# EAGLE design wifiToNmea2000 (EAGLE 7.7.0)
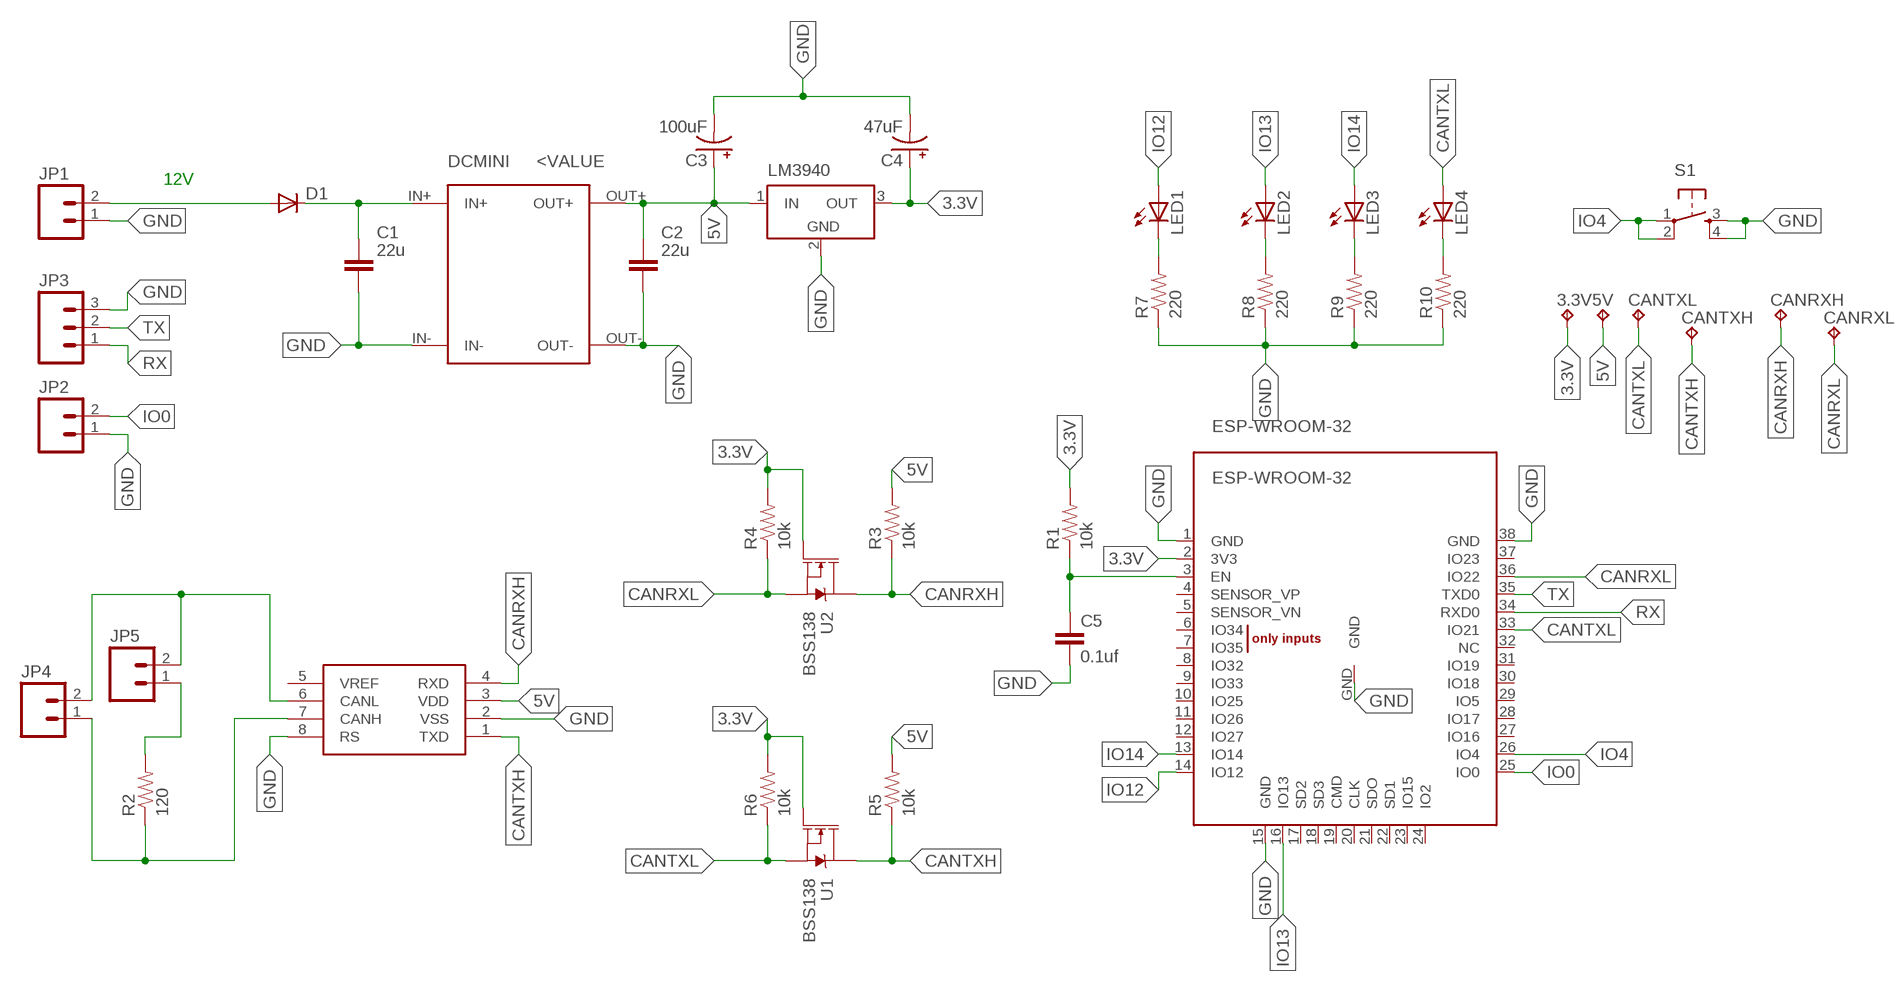
[diagram p0: schematic, sheet 1]

## Parts
3.3V  TPTP20R  [TP20R]
5V  TPTP20R  [TP20R]
C1  22u  CAPACITOR_NPOL-1206  [C1206]
C2  22u  CAPACITOR_NPOL-1206  [C1206]
C3  100uF  CAP_POLD  [PANASONIC_D]
C4  47uF  CAP_POLD  [PANASONIC_D]
C5  0.1uf  CAP0805  [0805]
CANRXH  TPTP20R  [TP20R]
CANRXL  TPTP20R  [TP20R]
CANTXH  TPTP20R  [TP20R]
CANTXL  TPTP20R  [TP20R]
D1  DIODE-DO214AC  [DO214AC]
DCMINI  DCDCMINI  [DCDCMINI]
ESP-WROOM-32  ESP-WROOM-32  [ESP-WROOM-32]
JP1  M02  [1X02_LONGPADS]
JP2  M02LOCK  [1X02_LOCK]
JP3  M03LOCK  [1X03_LOCK]
JP4  M02  [1X02_LONGPADS]
JP5  M02LOCK  [1X02_LOCK]
LED1  LED3MM  [LED3MM]
LED2  LED3MM  [LED3MM]
LED3  LED3MM  [LED3MM]
LED4  LED3MM  [LED3MM]
LM3940  LT1129CST5  [SOT223]
MCP2551  MCP2551  [SO08]
R1  10k  RESISTOR  [0805]
R2  120  RESISTOR  [0805]
R3  10k  RESISTOR  [0805]
R4  10k  RESISTOR  [0805]
R5  10k  RESISTOR  [0805]
R6  10k  RESISTOR  [0805]
R7  220  RESISTOR  [0805]
R8  220  RESISTOR  [0805]
R9  220  RESISTOR  [0805]
R10  220  RESISTOR  [0805]
S1  TAC_SWITCHPTH  [TACTILE-PTH]
U1  BSS138  BSS138BKW  [SOT65P210X110-3N]
U2  BSS138  BSS138BKW  [SOT65P210X110-3N]

## Nets
3.3V [Supply]: 3.3V.TP C4.+ ESP-WROOM-32.2(3V3) LM3940.3(OUT) R1.2 R4.2 R6.2 U1.1(G) U2.1(G)
5V [Supply]: 5V.TP C2.1 C3.+ DCMINI.OUT+ LM3940.1(IN) MCP2551.3(VDD) R3.2 R5.2
CANRXH: CANRXH.TP MCP2551.4(RXD) R3.1 U2.3(D)
CANRXL: CANRXL.TP ESP-WROOM-32.36(IO22) R4.1 U2.2(S)
CANTXH: CANTXH.TP MCP2551.1(TXD) R5.1 U1.3(D)
CANTXL: CANTXL.TP ESP-WROOM-32.33(IO21) LED4.A R6.1 U1.2(S)
GND: C1.2 C2.2 C3.- C4.- C5.2 DCMINI.IN- DCMINI.OUT- ESP-WROOM-32.1(GND) ESP-WROOM-32.15(GND) ESP-WROOM-32.38(GND) ESP-WROOM-32.GND JP1.1 JP2.1 JP3.3 LM3940.2(GND) MCP2551.2(VSS) MCP2551.8(RS) R7.1 R8.1 R9.1 R10.1 S1.3 S1.4
IO0: ESP-WROOM-32.25(IO0) JP2.2
IO4: ESP-WROOM-32.26(IO4) S1.1 S1.2
IO12: ESP-WROOM-32.14(IO12) LED1.A
IO13: ESP-WROOM-32.16(IO13) LED2.A
IO14: ESP-WROOM-32.13(IO14) LED3.A
N$1 [Supply]: D1.A JP1.2
N$2 [Supply]: C1.1 D1.C DCMINI.IN+
N$3 [Supply]: JP4.1 MCP2551.7(CANH) R2.1
N$4: JP4.2 JP5.2 MCP2551.6(CANL)
N$5: C5.1 ESP-WROOM-32.3(EN) R1.1
N$6: JP5.1 R2.2
N$7: LED1.K(C) R7.2
N$8: LED2.K(C) R8.2
N$9: LED3.K(C) R9.2
N$10: LED4.K(C) R10.2
RX: ESP-WROOM-32.34(RXD0) JP3.1
TX: ESP-WROOM-32.35(TXD0) JP3.2
Unconnected: ESP-WROOM-32.4(SENSOR_VP) ESP-WROOM-32.5(SENSOR_VN) ESP-WROOM-32.6(IO34) ESP-WROOM-32.7(IO35) ESP-WROOM-32.8(IO32) ESP-WROOM-32.9(IO33) ESP-WROOM-32.10(IO25) ESP-WROOM-32.11(IO26) ESP-WROOM-32.12(IO27) ESP-WROOM-32.17(SD2) ESP-WROOM-32.18(SD3) ESP-WROOM-32.19(CMD) ESP-WROOM-32.20(CLK) ESP-WROOM-32.21(SDO) ESP-WROOM-32.22(SD1) ESP-WROOM-32.23(IO15) ESP-WROOM-32.24(IO2) ESP-WROOM-32.27(IO16) ESP-WROOM-32.28(IO17) ESP-WROOM-32.29(IO5) ESP-WROOM-32.30(IO18) ESP-WROOM-32.31(IO19) ESP-WROOM-32.32(NC) ESP-WROOM-32.37(IO23) MCP2551.5(VREF)

## Notes on the sheet
- 12V

## Power pins joined to a net without a drawn wire
GND: LM3940.4(GND)

## Library data of the parts
3.3V 5V CANRXH CANRXL CANTXH CANTXL = testpad:TP: Test pad
C1 C2 = dp_devices.v6:CAPACITOR_NPOL: Non-Polarized capacitor in various packages
C3 C4 = SparkFun:CAP_POL: Capacitor Polarized These are standard SMD and PTH capacitors. Normally 10uF, 47uF, and 100uF in electrolytic and tantalum varieties. Always verify the external diameter of the through hole cap, it varies with capacity, voltage, and manufacturer. The EIA devices should be standard.
C5 = SparkFun:CAP: Capacitor Standard 0603 ceramic capacitor, and 0.1" leaded capacitor.
D1 = diode:DIODE-: DIODE
DCMINI = DCDCMINI:DCDCMINI
ESP-WROOM-32 = esp32:ESP-WROOM-32
JP1 JP2 JP4 JP5 = SparkFun:M02: Header 2 Standard 2-pin 0.1" header. Use with straight break away headers (SKU : PRT-00116), right angle break away headers (PRT-00553), swiss pins (PRT-00743), machine pins (PRT-00117), and female headers (PRT-00115). Molex polarized connector foot print use with SKU : PRT-08233 with associated crimp pins and housings.
JP3 = SparkFun:M03: Header 3 Standard 3-pin 0.1" header. Use with straight break away headers (SKU : PRT-00116), right angle break away headers (PRT-00553), swiss pins (PRT-00743), machine pins (PRT-00117), and female headers (PRT-00115). Molex polarized connector foot print use with SKU : PRT-08232 with associated crimp pins and housings.
LED1-LED4 = adafruit:LED: LED OSRAM: - CHIPLED LG R971, LG N971, LY N971, LG Q971, LY Q971, LO R971, LY R971 LH N974, LH R974 LS Q976, LO Q976, LY Q976 LO Q996 - Hyper CHIPLED LW Q18S LB Q993, LB Q99A, LB R99A - SideLED LS A670, LO A670, LY A670, LG A670, LP A670 LB A673, LV A673, LT A673, LW A673 LH A674 LY A675 LS A676, LA A676, LO A676, LY A676, LW A676 LS A679, LY A679, LG A679 - Hyper Micro SIDELED® LS Y876, LA Y876, LO Y876, LY Y876 LT Y87S - SmartLED LW L88C, LW L88S LB L89C, LB L89S, LG L890 LS L89K, LO L89K, LY L89K LS L896, LA L896, LO L896, LY L896 - TOPLED LS T670, LO T670, LY T670, LG T670, LP T670 LSG T670, LSP T670, LSY T670, LOP T670, LYG T670 LG T671, LOG T671, LSG T671 LB T673, LV T673, LT T673, LW T673 LH T674 LS T676, LA T676, LO T676, LY T676, LB T676, LH T676, LSB T676, LW T676 LB T67C, LV T67C, LT T67C, LS T67K, LO T67K, LY T67K, LW E67C LS E67B, LA E67B, LO E67B, LY E67B, LB E67C, LV E67C, LT E67C LW T67C LS T679, LY T679, LG T679 LS T770, LO T770, LY T770, LG T770, LP T770 LB T773, LV T773, LT T773, LW T773 LH T774 LS E675, LA E675, LY E675, LS T675 LS T776, LA T776, LO T776, LY T776, LB T776 LHGB T686 LT T68C, LB T68C - Hyper Mini TOPLED® LB M676 - Mini TOPLED Santana® LG M470 LS M47K, LO M47K, LY M47K Source: http://www.osram.convergy.de/
LM3940 = linear-technology-2:LT1129CST5: VOLTAGE REGULATOR with shutdown
MCP2551 = SparkFun:MCP2551
R1-R10 = SparkFun:RESISTOR: Resistor Basic schematic elements and footprints for 0603, 1206, and PTH 1/10th watt (small) resistors.
S1 = SparkFun:TAC_SWITCH: Momentary Switch Button commonly used for reset or general input. Spark Fun Electronics SKU : COM-00097
U1 U2 = BSS138:BSS138BKW: N-channel Trench MOSFET; MPN: BSS138BKW; OC_FARNELL: 2053836; OC_NEWARK: 61T7488; PACKAGE: SOT-23-3; SUPPLIER: NXP

## Net classes
1 Supply: width 0.635 mm

## Board
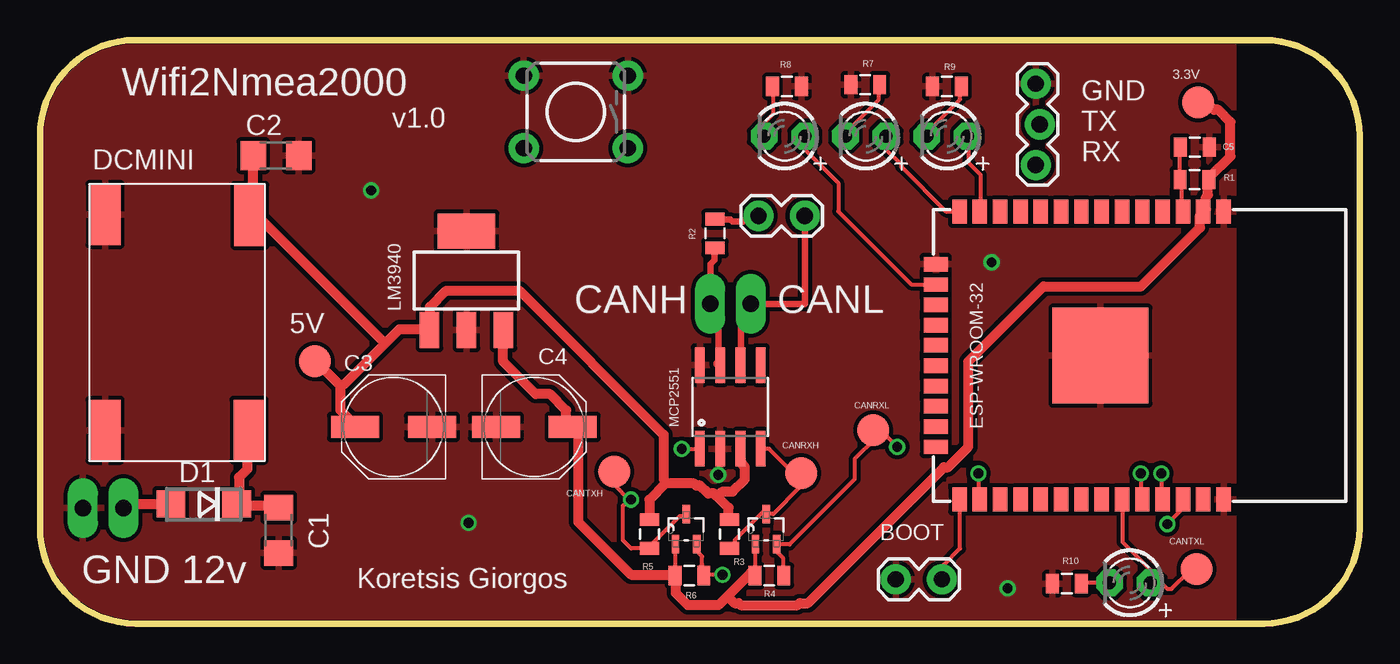
[diagram p1: board, top side]
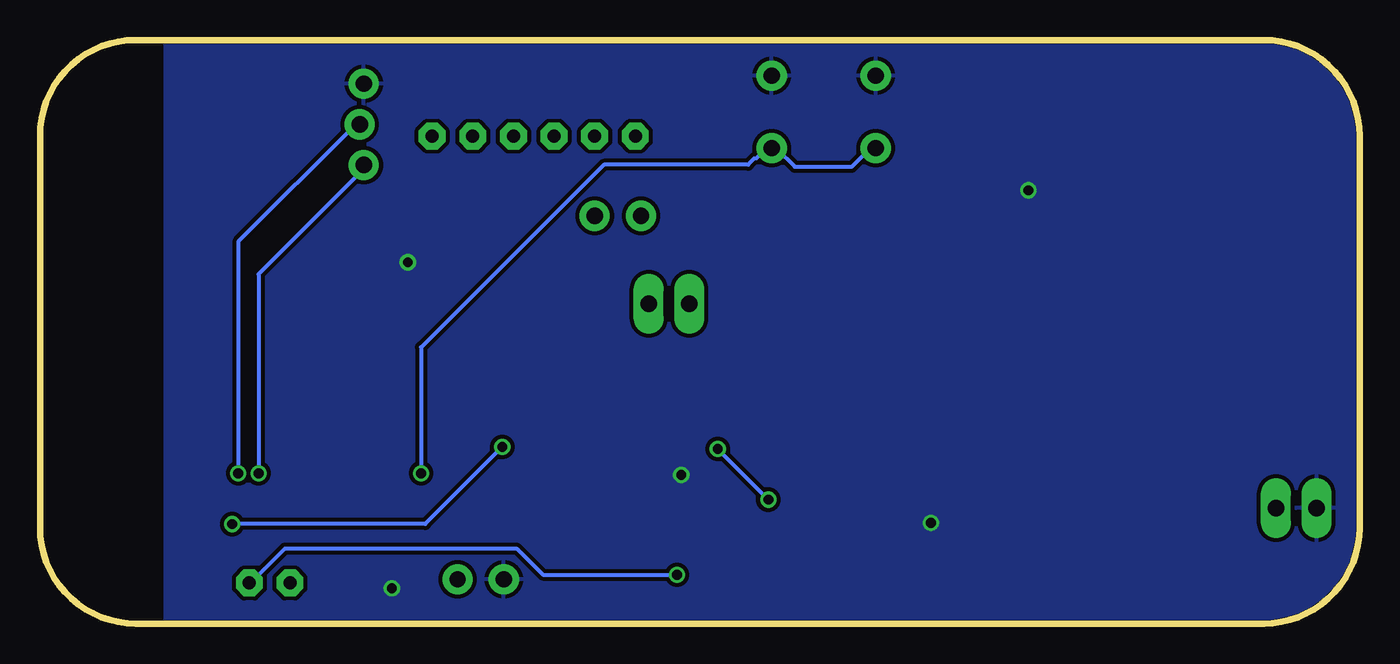
[diagram p2: board, bottom side, seen from below]

Size 82.5 x 36.5 mm. Coordinates in mm from the lower left corner, seen from the top.
Outline: 0,6 0,30.5 arc-90 6,36.5 76.5,36.5 arc-90 82.5,30.5 82.5,6 arc-90 76.5,0 6,0 arc-90 0,6
Copper layers (1*16): Top 0.035mm / dielectric 1.5mm / Bottom 0.035mm
Design rules "default *": minimum track width 10mil, minimum drill 24mil, track to track 10mil, track to pad 10mil, pad to pad 10mil, via to via 10mil, smd to smd 10mil, copper to edge 1mil, drill to drill 8mil, minimum pad ring 10mil, minimum via ring 8mil, stop-mask expansion 4mil, vias tented up to drill 0mil, thermal gap 10mil
tRestrict: area 75,0 to 82.5,36.5
bRestrict: area 75,0 to 82.5,36.5

### Footprints (pad centres in the part's own frame; a part is rotated, then mirrored left to right if it is on the bottom)
TP20R = smd 2 x 2: TP 0,0
C1206 = smd 1.6 x 1.803: 1 -1.422,0; 2 1.422,0
PANASONIC_D = smd 3 x 1.4: + 2.4,0; - -2.4,0
0805 = smd 0.8 x 1.2: 1 -0.9,0; 2 0.9,0
DO214AC = smd 1.8 x 1.7: A 2.05,0; C -2.05,0
DCDCMINI = smd 1.93 x 3.81: IN+ 10,1.9; IN- 1,1.9; OUT+ 10.05,15.34; OUT- 1,15.4
ESP-WROOM-32 = smd 0.9 x 1.5: 1 7.7,9; 2 6.43,9; 3 5.16,9; 4 3.89,9; 5 2.62,9; 6 1.35,9; 7 0.08,9; 8 -1.19,9; 9 -2.46,9; 10 -3.73,9; 11 -5,9; 12 -6.27,9; 13 -7.54,9; 14 -8.81,9; 25 -8.81,-9; 26 -7.54,-9; 27 -6.27,-9; 28 -5,-9; 29 -3.73,-9; 30 -2.46,-9; 31 -1.19,-9; 32 0.08,-9; 33 1.35,-9; 34 2.62,-9; 35 3.89,-9; 36 5.16,-9; 37 6.43,-9; 38 7.7,-9 | smd 1.5 x 0.9: 15 -10.3,5.715; 16 -10.3,4.445; 17 -10.3,3.175; 18 -10.3,1.905; 19 -10.3,0.635; 20 -10.3,-0.635; 21 -10.3,-1.905; 22 -10.3,-3.175; 23 -10.3,-4.445; 24 -10.3,-5.715 | smd 6 x 6: GND 0,0
1X02_LONGPADS = drill 1.016 pad 1.88 long: 1 0,0; 2 2.54,0
1X02_LOCK = drill 1.016 pad 1.88: 1 -0.178,0; 2 2.718,0
1X03_LOCK = drill 1.016 pad 1.88: 1 0,0.127; 2 2.54,-0.127; 3 5.08,0.127
LED3MM = drill 0.813 pad 1.676 octagon: A -1.27,0; K 1.27,0
SOT223 = smd 1.219 x 2.235: 1 -2.311,-3.099; 2 0,-3.099; 3 2.311,-3.099 | smd 3.6 x 2.2: 4 0,3.099
SO08 = smd 0.61 x 2.21: 1 -1.905,-2.616; 2 -0.635,-2.616; 3 0.635,-2.616; 4 1.905,-2.616; 5 1.905,2.616; 6 0.635,2.616; 7 -0.635,2.616; 8 -1.905,2.616
TACTILE-PTH = drill 1.016 pad 1.88: 1 -3.251,2.261; 2 3.251,2.261; 3 -3.251,-2.261; 4 3.251,-2.261
SOT65P210X110-3N = smd 1.168 x 0.457: 1 -0.94,0.66; 2 -0.94,-0.66; 3 0.94,0

### Placement (x,y rotation side)
3.3V  72.4,32.6 0 top
5V  17.2,16.4 0 top
C1  14.92,5.84 270 top
C2  14.76,29.27 0 top
C3  22.1,12.3 180 top
C4  30.9,12.3 0 top
C5  72.2,29.8 0 top
CANRXH  47.6,9.4 0 top
CANRXL  52.1,12.1 0 top
CANTXH  35.9,9.5 0 top
CANTXL  72.3,3.4 0 top
D1  10.24,7.48 180 top
DCMINI  3.07,10.18 0 top
ESP-WROOM-32  66.3,16.76 0 top
JP1  2.68,7.22 0 top
JP2  53.68,2.77 0 top
JP3  62.38,28.68 90 top
JP4  41.9,20 0 top
JP5  45.1,25.5 0 top
LED1  51.63,30.48 180 top
LED2  46.55,30.48 180 top
LED3  56.71,30.48 180 top
LED4  68.14,2.54 180 top
LM3940  26.66,21.45 0 top
MCP2551  43.16,13.55 0 top
R1  72.18,27.77 0 top
R2  42.2,24.4 90 top
R3  43.1,5.6 90 top
R4  45.6,3 180 top
R5  38.1,5.6 90 top
R6  40.6,3 180 top
R7  51.6,33.7 0 top
R8  46.7,33.6 180 top
R9  56.7,33.6 0 top
R10  64.2,2.5 0 top
S1  33.5,32 180 top
U1  40.4,5.9 90 top
U2  45.4,5.9 90 top

### Tracks (layer width: path | path; a pad name or v marks a point on that pad's centre or on a via)
3.3V
  Top 0.254: R6.2 39.74,3 U1.1 | 44.45,3.17 44.74,3.17 U2.1
  Top 0.635: 3.3V.TP 72.52,32.51 73.03,32.51 73.41,32.13 73.66,32.13 74.42,31.37 74.42,29.21 73.15,27.94 R1.2 73.03,27.69 73.03,26.8 72.9,26.67 72.9,25.91 72.77,25.78 ESP-WROOM-32.2 72.52,25.53 72.52,24.77 68.83,21.08 62.74,21.08 58.04,16.38 58.04,11.05 56.77,9.78 56.52,9.78 48.01,1.27 47.5,1.27 47.37,1.14 43.81,1.14 43.69,1.27 43.43,1.27 42.99,1.71 | 42.99,1.71 44.45,3.17 R4.2 | 42.99,1.71 42.42,1.14 40.51,1.14 39.75,1.91 39.75,2.79 R6.2 39.37,3.05 36.96,3.05 33.66,6.35 33.66,11.81 33.4,12.06 C4.+ 33.27,12.32 32.89,12.7 32.89,13.34 31.88,14.35 30.99,14.35 28.96,16.38 28.96,18.29 LM3940.3
5V
  Top 0.635: R5.2 38.1,7.75 39.12,8.76 | 39.12,8.76 40.89,8.76 41.02,8.64 41.27,8.64 41.78,8.13 42.16,8.13 42.35,7.94 | 42.35,7.94 43.05,7.24 43.05,6.6 R3.2 | MCP2551.3 43.81,10.92 43.81,10.03 44.07,9.78 44.07,9.02 43.31,8.26 42.67,8.26 42.35,7.94 | C2.1 13.34,29.21 13.34,25.65 13.21,25.53 DCMINI.OUT+ 13.59,25.53 21.59,17.53 | 18.8,14.86 17.27,16.38 5V.TP | 18.8,14.86 18.8,13.34 19.81,12.32 C3.+ | 21.59,17.53 19.05,14.99 18.8,14.86 | 21.59,17.53 22.48,18.41 24.26,18.41 LM3940.1 24.38,18.67 24.38,19.81 25.4,20.83 29.97,20.83 38.99,11.81 38.99,9.02 39.12,8.76
CANRXH
  Top 0.254: R3.1 43.18,4.83 43.43,5.08 43.43,5.21 45.21,6.99 45.47,6.99 U2.3 45.47,6.86 45.85,6.86 47.5,8.51 47.5,9.4 CANRXH.TP 47.37,9.4 47.12,9.4 45.59,10.92 45.09,10.92 MCP2551.4
CANRXL  (via drill 0.61)
  Top 0.254: R4.1 46.48,3.05 46.48,4.06 46.1,4.45 46.1,4.95 U2.2 46.23,4.95 46.86,4.95 50.93,9.02 50.93,10.29 52.2,11.56 52.2,11.94 CANRXL.TP 52.2,12.06 52.58,12.06 v53.59,11.05 | v70.48,6.22 71.37,7.11 71.37,7.75 ESP-WROOM-32.36
  Bottom 0.254: v70.48,6.22 58.42,6.22 v53.59,11.05
CANTXH  (via drill 0.61)
  Top 0.254: U1.3 40.39,6.73 40.01,6.73 38.1,4.83 R5.1 36.96,4.7 36.45,5.21 36.45,7.37 36.83,7.75 | 36.83,7.75 35.94,8.64 35.94,9.4 CANTXH.TP | v40.13,10.92 41.15,10.92 MCP2551.1 | 36.83,7.75 v36.96,7.75
  Bottom 0.254: v36.96,7.75 v40.13,10.92
CANTXL  (via drill 0.61)
  Top 0.254: U1.2 41.15,4.95 41.15,4.45 41.4,4.19 41.4,3.68 41.27,3.56 41.27,3.17 41.4,3.05 R6.1 41.53,3.05 v42.67,3.05 | 69.47,2.54 69.47,3.3 67.69,5.08 67.69,7.75 ESP-WROOM-32.33 | 69.47,2.54 70.1,2.54 70.48,2.16 70.74,2.16 71.88,3.3 72.26,3.3 CANTXL.TP | 69.47,2.54 LED4.A
  Bottom 0.254: v42.67,3.05 51.05,3.05 52.7,4.7 67.18,4.7 69.34,2.54 LED4.A
GND  (via drill 0.61)
  other vias: 59.5,22.6 60.5,2.2 20.7,27.1 26.8,6.3 42.4,9.3
  pour Top: -2.3,-0.4 -1,40.7 88.2,40.7 88.2,-2 -2.3,-2
  pour Bottom: -2.8,-0.9 -2.3,38.7 86.8,38.3 86.2,-2.9 -2.6,-1.9
IO0
  Top 0.254: ESP-WROOM-32.25 57.53,7.75 57.53,4.7 56.52,3.68 56.52,2.79 JP2.2
IO4  (via drill 0.61)
  Top 0.254: v58.67,9.4 58.67,7.87 ESP-WROOM-32.26
  Bottom 0.254: v58.67,9.4 58.67,17.27 47.24,28.7 38.23,28.7 37.85,29.08 37.72,29.08 37.08,29.72 36.83,29.72 S1.1 36.7,29.72 36.45,29.72 35.31,28.57 31.75,28.57 30.61,29.72 30.35,29.72 S1.2
IO12
  Top 0.254: ESP-WROOM-32.14 57.4,25.78 56.64,25.78 53.85,28.57 53.85,28.7 52.83,29.72 52.83,30.48 LED1.A
IO13
  Top 0.254: ESP-WROOM-32.16 55.88,21.21 54.48,21.21 49.91,25.78 49.91,27.56 47.75,29.72 47.75,30.48 LED2.A
IO14
  Top 0.254: ESP-WROOM-32.13 58.8,25.78 58.8,28.07 58.04,28.83 58.04,30.48 LED3.A
N$1
  Top 0.635: D1.A 8.13,7.49 5.59,7.49 5.33,7.24 JP1.2
N$2
  Top 0.635: C1.1 14.86,7.37 12.32,7.37 D1.C 12.45,7.75 12.45,9.14 12.95,9.65 12.95,12.06 DCMINI.IN+
N$3
  Top 0.406: 42.16,23.5 42.16,22.73 41.91,22.48 41.91,20.07 JP4.1 42.16,19.81 42.42,19.56 42.42,16.26
  Top 0.635: 42.16,23.5 R2.1 | 42.42,16.26 MCP2551.7
N$4
  Top 0.254: 43.81,16.26 MCP2551.6 | 44.32,19.94 JP4.2
  Top 0.406: 43.81,16.26 43.81,19.43 44.32,19.94 | JP4.2 47.82,20 JP5.2
N$5
  Top 0.254: C5.1 71.25,29.72 71.25,27.81 R1.1 71.37,27.69 71.37,25.78 ESP-WROOM-32.3
N$6
  Top 0.254: 42.29,25.27 R2.2 | 44.83,25.4 JP5.1
  Top 0.406: 42.29,25.27 43.18,25.27 43.31,25.15 43.94,25.15 44.2,25.4 44.83,25.4
N$7
  Top 0.254: R7.2 52.45,33.66 52.45,32.77 50.42,30.73 50.42,30.48 LED1.K
N$8
  Top 0.254: R8.2 45.85,33.53 45.85,31.88 45.21,31.24 45.21,30.48 LED2.K
N$9
  Top 0.254: R9.2 57.53,33.53 57.53,32.77 55.5,30.73 55.5,30.48 LED3.K
N$10
  Top 0.254: LED4.K 65.15,2.54 R10.2
RX  (via drill 0.61)
  Top 0.254: v68.83,9.4 68.83,7.87 ESP-WROOM-32.34
  Bottom 0.254: v68.83,9.4 68.83,21.84 62.36,28.32 62.36,28.57 JP3.1
TX  (via drill 0.61)
  Top 0.254: v70.1,9.4 70.1,7.87 ESP-WROOM-32.35
  Bottom 0.254: v70.1,9.4 70.1,23.88 62.87,31.11 62.61,31.11 JP3.2

### Text on the board
tNames: Wifi2Nmea2000 | v1.0 | GND / TX / RX | CANH | CANL | BOOT | GND 12v | Koretsis Giorgos